# EasyEDA schematic SCH_SDCARD-DOCK_2024-07-07.json
TITLE: Sheet_1; REV: 1.0; Date: 2024-06-27; Sheet: 1/1
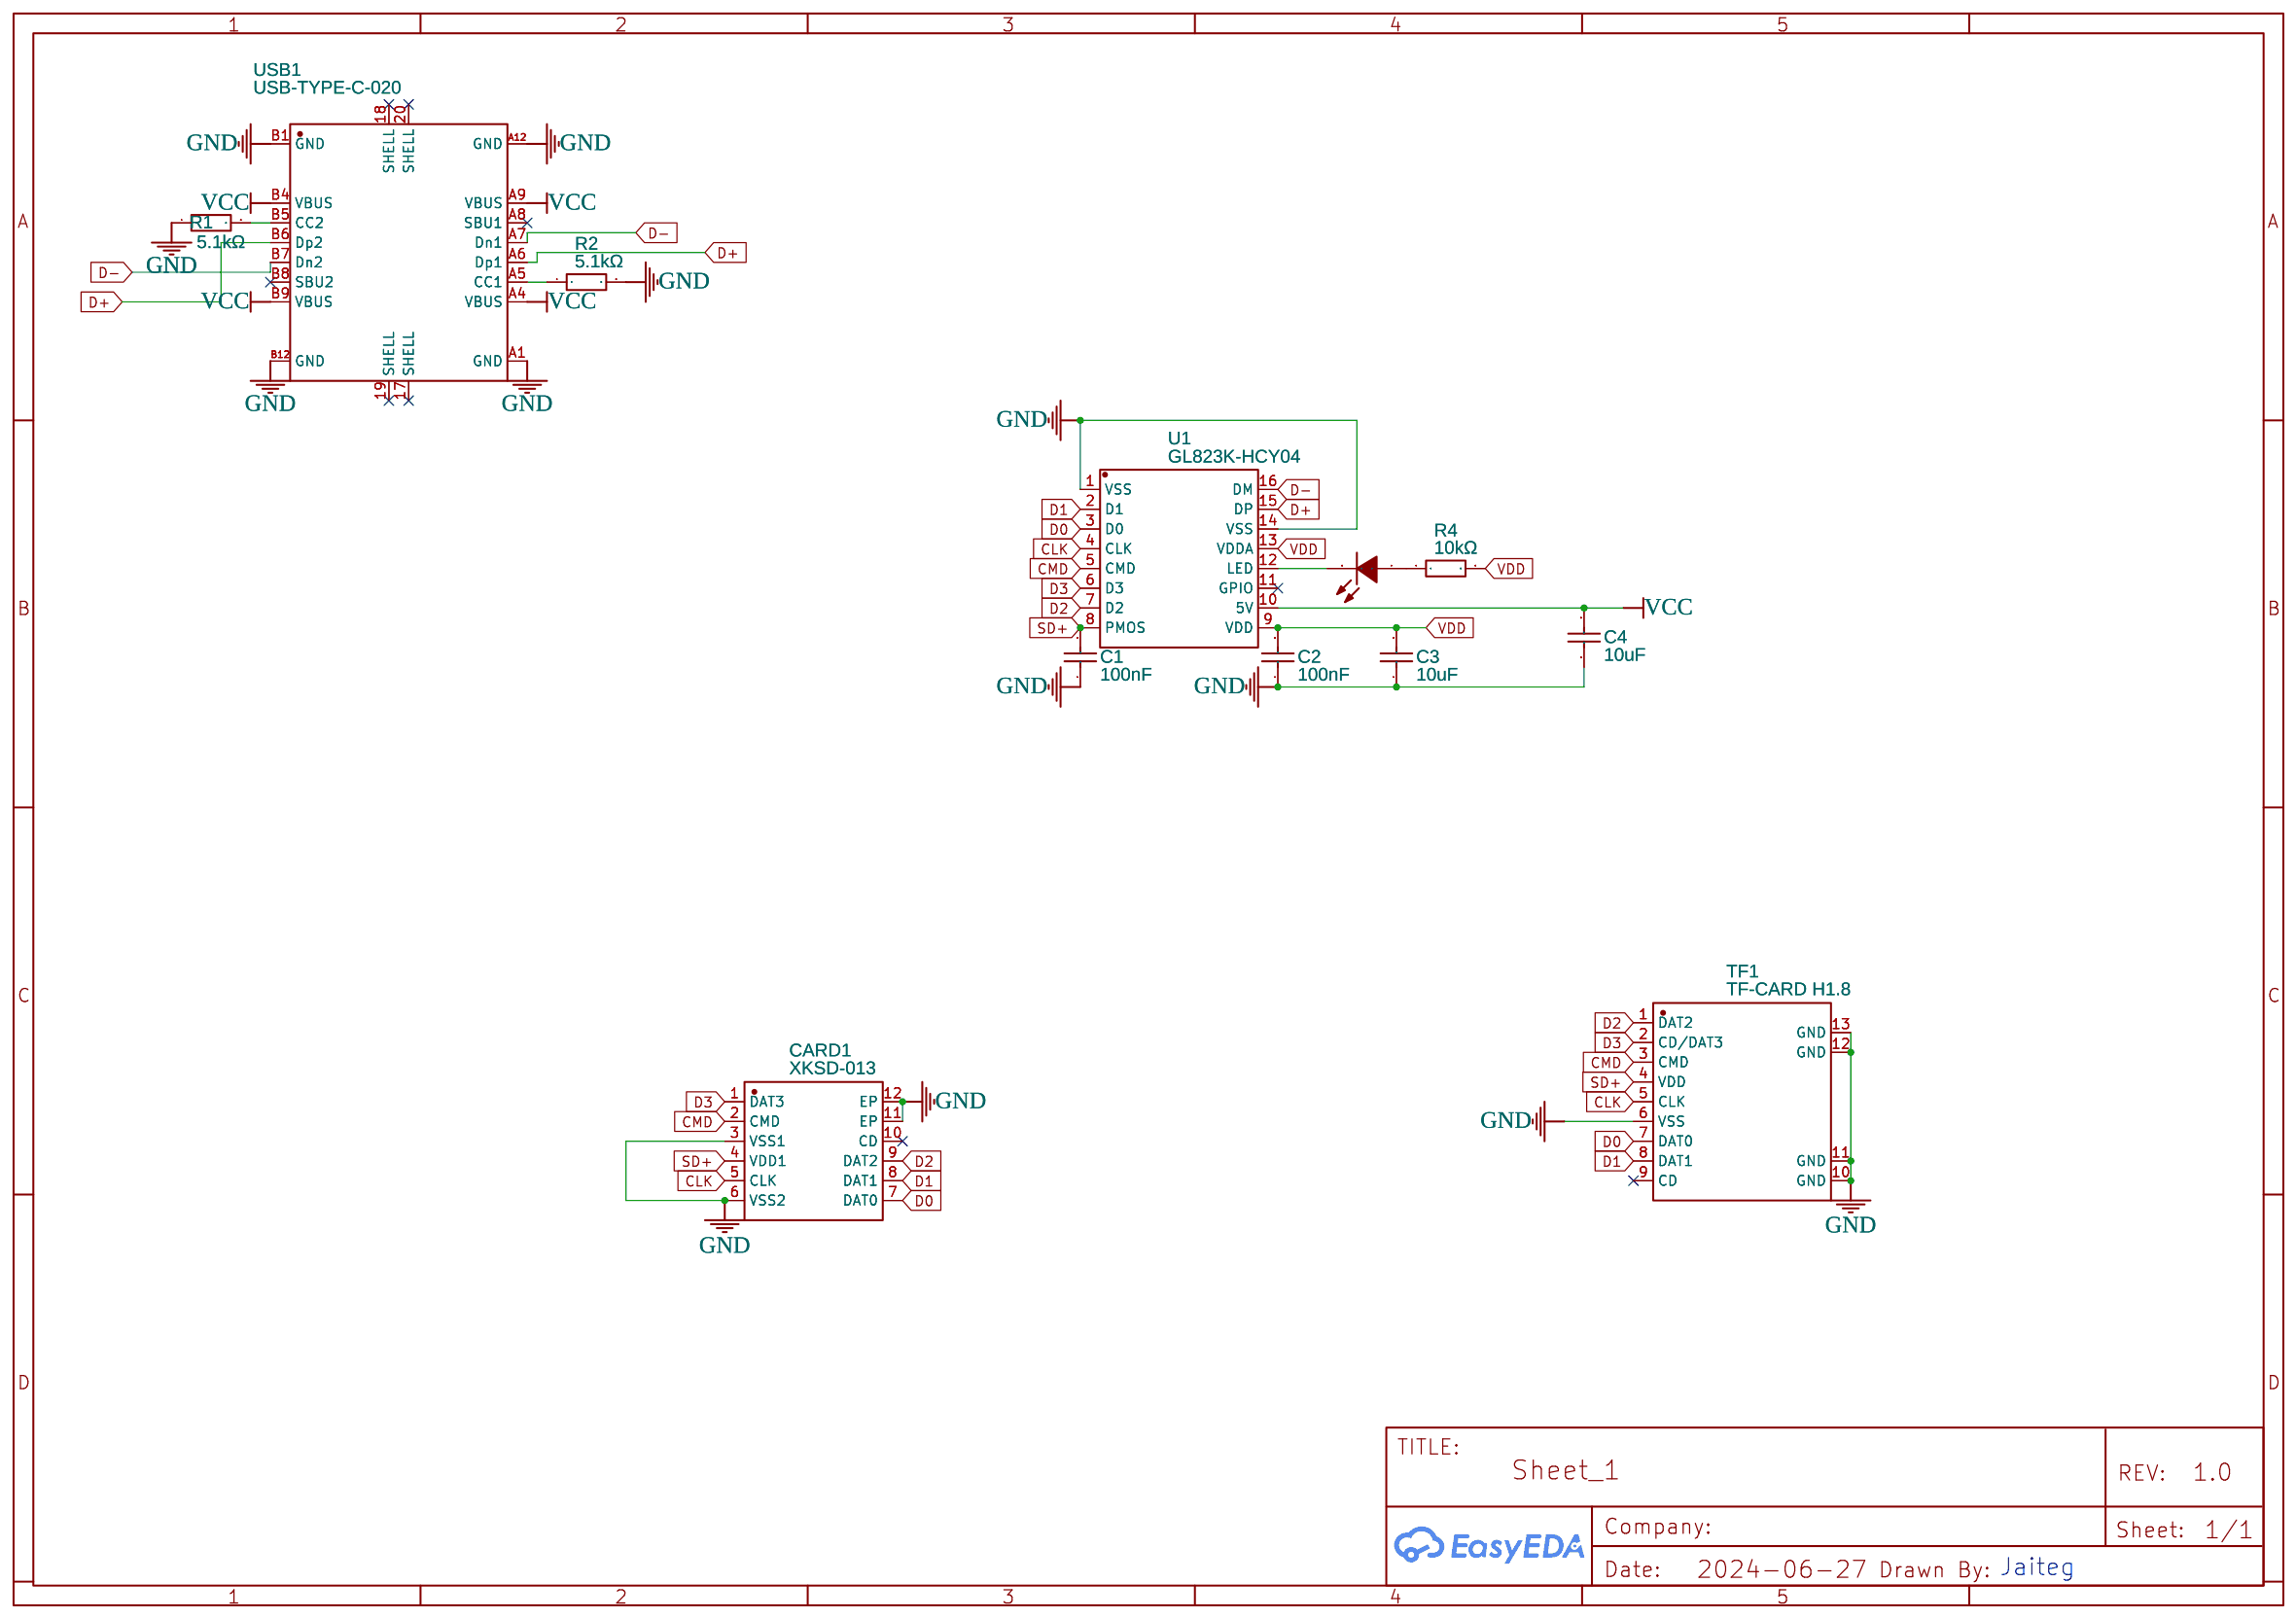
[diagram p0: schematic sheet]

## Parts
C1  100nF  [C0402]
C2  100nF  [C0402]
C3  10uF  [C0402]
C4  10uF  [C0402]
CARD1  XKSD-013  [SIM-SMD_XKSD-013]
LED2  0603White light_C2290  [LED0603-R-RD_WHITE]
R1  5.1kΩ  [R0402]
R2  5.1kΩ  [R0402]
R4  10kΩ  [R0805]
TF1  TF-CARD H1.8  [TF-SMD_TF-CARD-H1.8]
U1  GL823K-HCY04  [SSOP-16_L4.9-W3.9-P0.64-LS6.0-BL]
USB1  USB-TYPE-C-020  [USB-SMD_USB-TYPE-C-020]

## Library data of the parts
C1 C2 = CL05B104KO5NNNC: Supplier: LCSC; Manufacturer: SAMSUNG(三星); Supplier Part: C1525; JLCPCB Part Class: Basic Part
C3 C4 = CL05A106MQ5NUNC: Supplier: LCSC; Manufacturer: SAMSUNG(三星); Supplier Part: C15525; JLCPCB Part Class: Basic Part
CARD1 = XKSD-013: Contributor: LCSC; Supplier: LCSC; Supplier Part: C2764609; Manufacturer: XKB Connectivity(中国星坤); JLCPCB Part Class: Extended Part
LED2 = 0603White light_C2290: Supplier: LCSC; Manufacturer: KENTO; Manufacturer Part: KT-0603白灯; Supplier Part: C2290; JLCPCB Part Class: Basic Part
R1 R2 = 0402WGF5101TCE: Supplier: LCSC; Manufacturer: UNI-ROYAL(厚声); Supplier Part: C25905; JLCPCB Part Class: Basic Part
R4 = 0805W8F1002T5E: Supplier: LCSC; Manufacturer: UNI-ROYAL(厚声); Supplier Part: C17414; JLCPCB Part Class: Basic Part
TF1 = TF-CARD H1.8: Supplier: LCSC; Supplier Part: C7529389; Manufacturer: SHOU HAN(首韩); Contributor: lcsc; JLCPCB Part Class: Extended Part
U1 = GL823K-HCY04: Contributor: LCSC; Supplier: LCSC; Supplier Part: C284879; Manufacturer: GENESYS(创惟); JLCPCB Part Class: Extended Part
USB1 = USB-TYPE-C-020: Supplier: LCSC; Supplier Part: C2927040; Manufacturer: DEALON(德艺隆); Contributor: lcsc

## Nets
GND: C1.1 C2.1 C3.1 C4.1 CARD1.3(VSS1) CARD1.6(VSS2) CARD1.11(EP) CARD1.12(EP) R1.1 R2.2 TF1.6(VSS) TF1.10(GND) TF1.11(GND) TF1.12(GND) TF1.13(GND) U1.1(VSS) U1.14(VSS) USB1.A1(GND) USB1.A12(GND) USB1.B1(GND) USB1.B12(GND)
VCC: C4.2 U1.10(5V) USB1.A4(VBUS) USB1.A9(VBUS) USB1.B4(VBUS) USB1.B9(VBUS)
VDD: C2.2 C3.2 R4.2 U1.9(VDD) U1.13(VDDA)
CLK: CARD1.5(CLK) TF1.5(CLK) U1.4(CLK)
CMD: CARD1.2(CMD) TF1.3(CMD) U1.5(CMD)
D0: CARD1.7(DAT0) TF1.7(DAT0) U1.3(D0)
D1: CARD1.8(DAT1) TF1.8(DAT1) U1.2(D1)
D2: CARD1.9(DAT2) TF1.1(DAT2) U1.7(D2)
D3: CARD1.1(DAT3) TF1.2(CD/DAT3) U1.6(D3)
D+: U1.15(DP) USB1.A6(Dp1) USB1.B6(Dp2)
D-: U1.16(DM) USB1.A7(Dn1) USB1.B7(Dn2)
SD+: C1.2 CARD1.4(VDD1) TF1.4(VDD) U1.8(PMOS)
Net-(LED2-1): LED2.1(A) R4.1
Net-(LED2-2): LED2.2(K) U1.12(LED)
Net-(R1-2): R1.2 USB1.B5(CC2)
Net-(R2-1): R2.1 USB1.A5(CC1)

Not connected (* = marked no-connect by the designer): CARD1 10(CD)*; TF1 9(CD)*; U1 11(GPIO)*; USB1 17(SHELL)* 18(SHELL)* 19(SHELL)* 20(SHELL)* A8(SBU1)* B8(SBU2)*

## Notes on the sheet
- Jaiteg
